# Altium schematic sheet CPU_EX.SchDoc
size B; Author: E. Sims; Organization: Let's Build Rockets Inc.
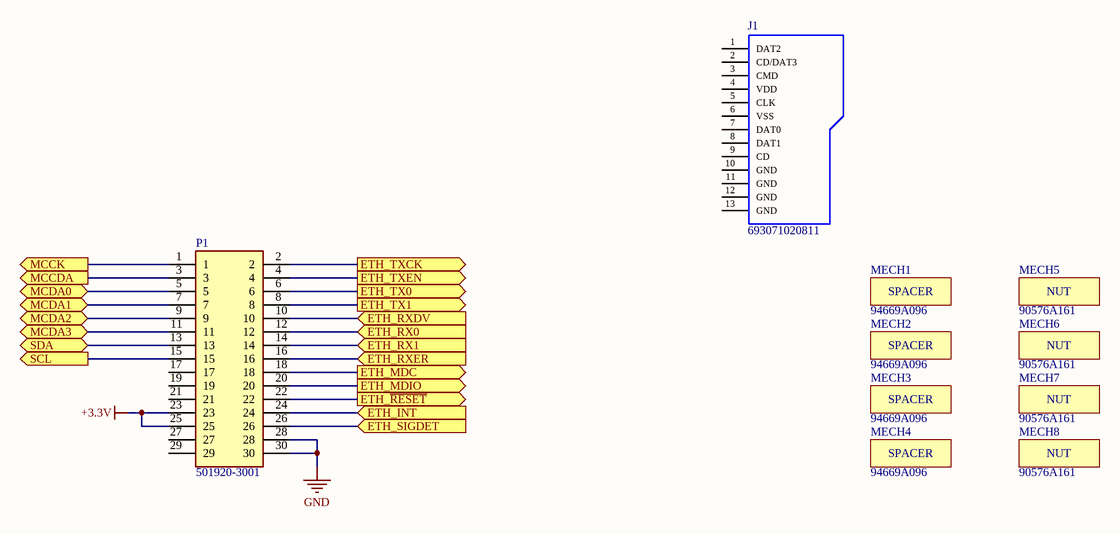
[diagram p0: CPU_EX.SchDoc]

## Parts
J1  693071020811  [693071020811]
MECH1  94669A096  [94669A096]
MECH2  94669A096  [94669A096]
MECH3  94669A096  [94669A096]
MECH4  94669A096  [94669A096]
MECH5  90576A161  [90576A161]
MECH6  90576A161  [90576A161]
MECH7  90576A161  [90576A161]
MECH8  90576A161  [90576A161]
P1  501920-3001  [5019203001]

## Ports
ETH_INT (in), ETH_MDC (out), ETH_MDIO (out), ETH_RX0 (in), ETH_RX1 (in), ETH_RXDV (in), ETH_RXER (in), ETH_SIGDET (in), ETH_TX0 (out), ETH_TX1 (out), ETH_TXCK (out), ETH_TXEN (out), ETH_~{RESET} (out), MCCDA (out), MCCK (out), MCDA0 (bidir), MCDA1 (bidir), MCDA2 (bidir), MCDA3 (bidir), SCL (out), SDA (bidir)

## Nets
+3.3V: P1.23 P1.25
GND: P1.28 P1.30
ETH_INT: P1.24 ; port ETH_INT
ETH_MDC: P1.18 ; port ETH_MDC
ETH_MDIO: P1.20 ; port ETH_MDIO
ETH_~{RESET}: P1.22 ; port ETH_~{RESET}
ETH_RX0: P1.12 ; port ETH_RX0
ETH_RX1: P1.14 ; port ETH_RX1
ETH_RXDV: P1.10 ; port ETH_RXDV
ETH_RXER: P1.16 ; port ETH_RXER
ETH_SIGDET: P1.26 ; port ETH_SIGDET
ETH_TX0: P1.6 ; port ETH_TX0
ETH_TX1: P1.8 ; port ETH_TX1
ETH_TXCK: P1.2 ; port ETH_TXCK
ETH_TXEN: P1.4 ; port ETH_TXEN
MCCDA: P1.3 ; port MCCDA
MCCK: P1.1 ; port MCCK
MCDA0: P1.5 ; port MCDA0
MCDA1: P1.7 ; port MCDA1
MCDA2: P1.9 ; port MCDA2
MCDA3: P1.11 ; port MCDA3
SCL: P1.15 ; port SCL
SDA: P1.13 ; port SDA

Not connected (* = marked no-connect by the designer): J1 1(DAT2) 2(CD/DAT3) 3(CMD) 4(VDD) 5(CLK) 6(VSS) 7(DAT0) 8(DAT1) 9(CD) 10(GND) 11(GND) 12(GND) 13(GND); P1 17 19 21 27 29

## Notes on the sheet
- Let's Build Rocket's Inc. Modular Paylaod System Based on TMP-010 Rev
  For more information visit https://github.com/LetsBuildRockets/Modular-Payload-System
  This work is licensed under CC BY-NC 4.0. To view a copy of this license, visit https://creativecommons.org/licenses/by-nc/4.0
- Title
- Size:
- Date:
- Assembly Variant:
- B
- Number:
- Time:
- Revision:
- Sheet
- of
- Author:
- File:
- (in symbol 90576A161) NUT
- (in symbol 94669A096) SPACER

## Library data of the parts
J1 = 693071020811: WR-CRD Micro SD Card Connector Push & Push; Contact Resistance: 100mOhm; Gender: Socket; Pin Number: 8; Working Voltage: 30VAC; Withstanding Voltage: 500VAC; Rated Current: 0.5A; Unit Price (USD): 3.71; ComponentLink1Description: Manufacturer; ComponentLink1URL: http://www.we-online.de; ComponentLink2Description: Datasheet; ComponentLink2URL: https://katalog.we-online.com/em/datasheet/693071020811.pdf; Packaging: Tape and Reel; Published Date: November 2019; Publisher: Wurth Elektronik; Mounting Technology: SMT; Operating Temperature: -40 to +85degC; Part Number: 693071020811; Type: Push & Push
MECH1-MECH4 = 94669A096: Unit Price (USD): 0.41
MECH5-MECH8 = 90576A161: Unit Price (USD): 0.27
P1 = 501920-3001: Connector; Manufacturer_Name: Molex; Unit Price (USD): 2.86; Datasheet Link: https://www.molex.com/pdm_docs/sd/5019203001_sd.pdf; Height: 3.62mm; Manufacturer_Part_Number: 501920-3001; System: Connector